# EAGLE design Qwiic_MLX90393_Magnetometer (EAGLE 7.7.0)
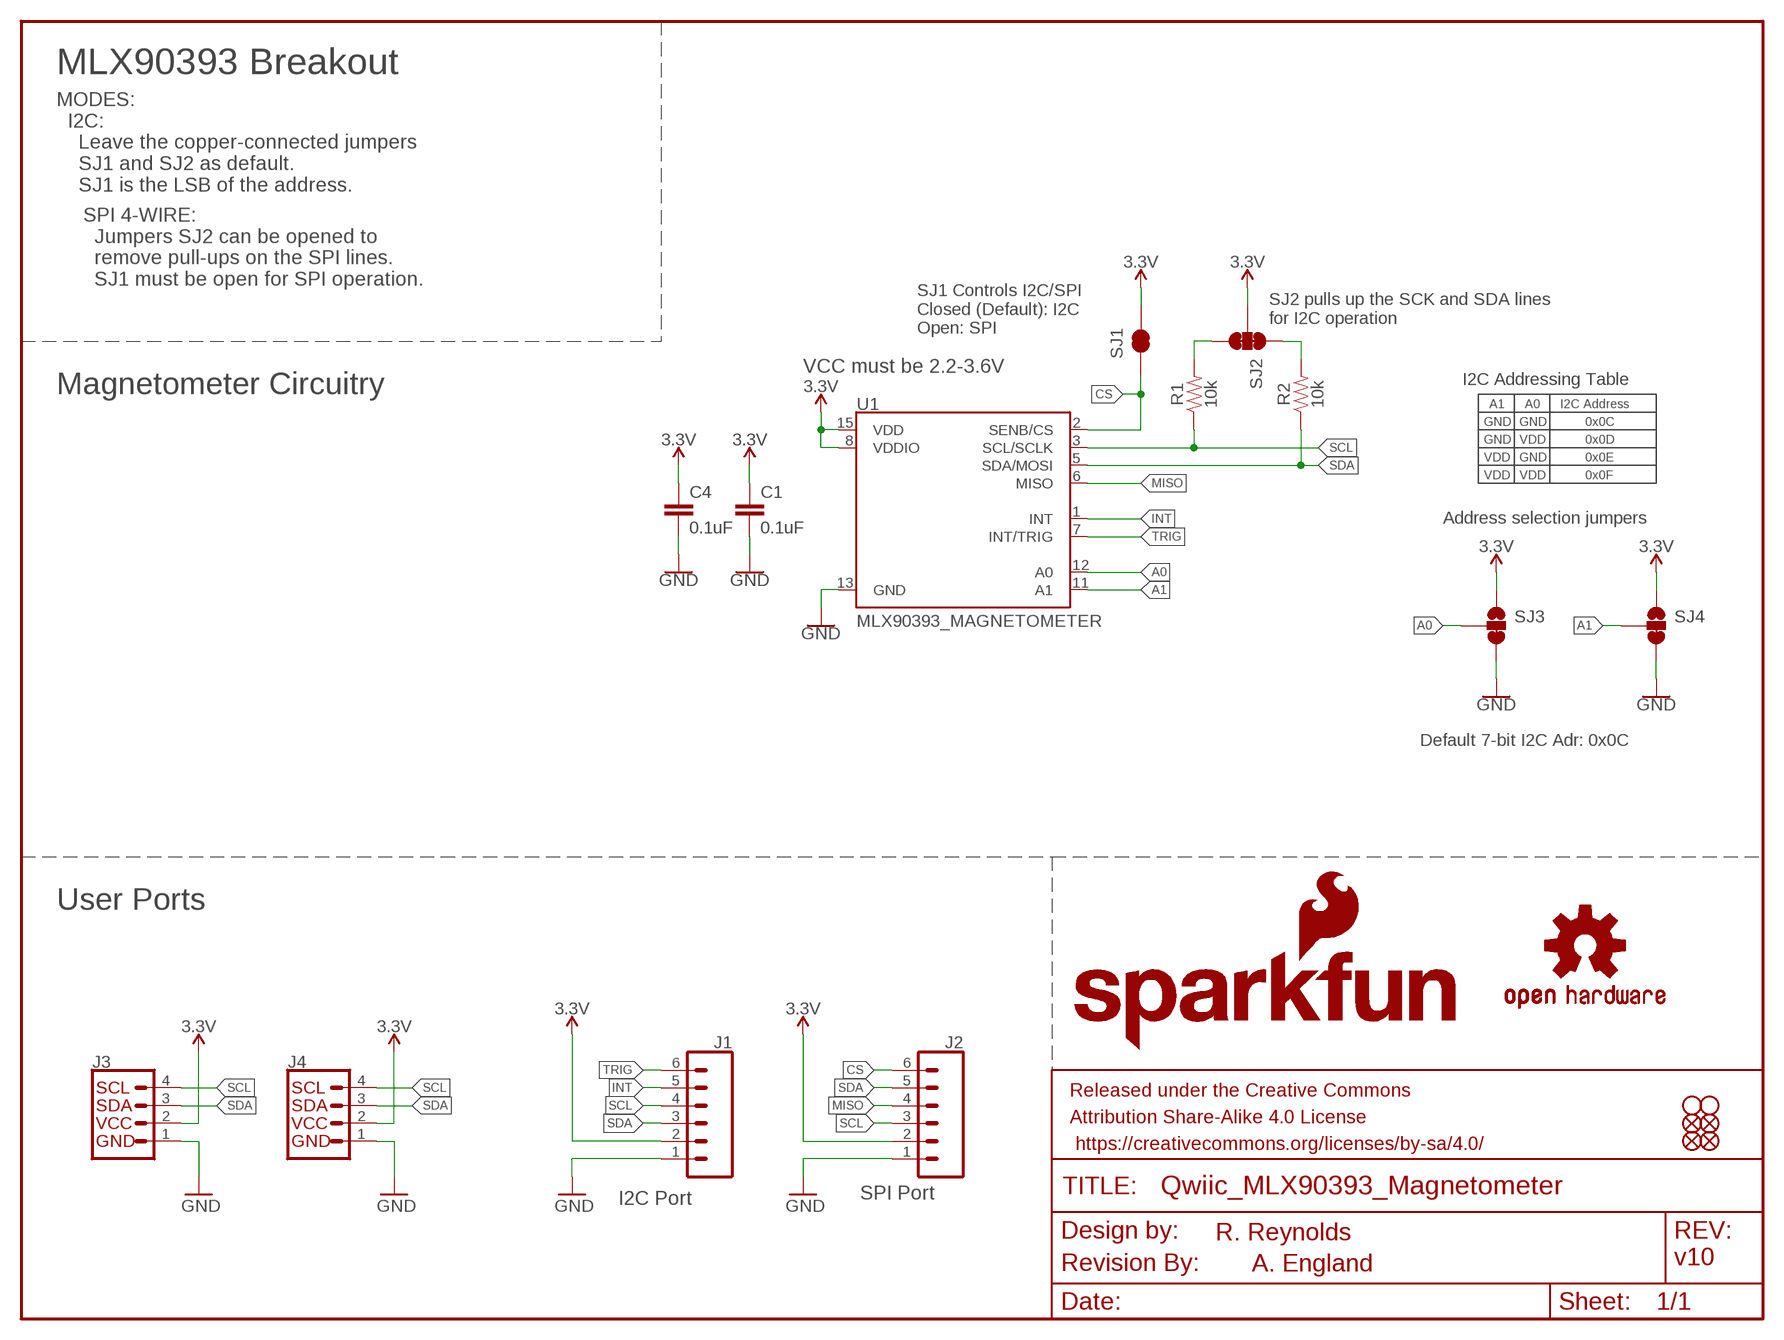
[diagram p0: schematic, sheet 1]

## Parts
C1  0.1uF  0.1UF-0603-25V-(+80/-20%)  [0603]
C4  0.1uF  0.1UF-0603-25V-(+80/-20%)  [0603]
FD1  FIDUCIALUFIDUCIAL  [FIDUCIAL-MICRO]
FD2  FIDUCIALUFIDUCIAL  [FIDUCIAL-MICRO]
FD3  FIDUCIALUFIDUCIAL  [FIDUCIAL-MICRO]
FD4  FIDUCIALUFIDUCIAL  [FIDUCIAL-MICRO]
FRAME2  FRAME-LETTER  [CREATIVE_COMMONS]
J1  CONN_06NO_SILK_FEMALE_PTH  [1X06_NO_SILK]
J2  CONN_06NO_SILK_FEMALE_PTH  [1X06_NO_SILK]
J3  QWIIC_CONNECTORJS-1MM  [1X04_1MM_RA]
J4  QWIIC_CONNECTORJS-1MM  [1X04_1MM_RA]
JP3  STAND-OFF  [STAND-OFF]
JP4  STAND-OFF  [STAND-OFF]
LOGO1  SFE_LOGO_NAME_FLAME.1_INCH  [SFE_LOGO_NAME_FLAME_.1]
LOGO2  SFE_LOGO_FLAME.1_INCH  [SFE_LOGO_FLAME_.1]
LOGO3  REVISION  [REVISION]
R1  10k  10KOHM-0603-1/10W-1%  [0603]
R2  10k  10KOHM-0603-1/10W-1%  [0603]
SJ1  JUMPER-SMT_2_NC_TRACE_SILK  [SMT-JUMPER_2_NC_TRACE_SILK]
SJ2  JUMPER-PAD-3-NC_BY_TRACE  [PAD-JUMPER-3-3OF3_NC_BY_TRACE_YES_SILK_FULL_BOX]
SJ3  JUMPER-SMT_3_1-NC_TRACE_SILK  [SMT-JUMPER_3_1-NC_TRACE_SILK]
SJ4  JUMPER-SMT_3_1-NC_TRACE_SILK  [SMT-JUMPER_3_1-NC_TRACE_SILK]
U1  MLX90393_MAGNETOMETER  [QFN-16_WITH_AXIES]
U$1  OSHW-LOGOS  [OSHW-LOGO-S]

## Nets
3.3V: C1.1 C4.1 J1.2 J2.2 J3.2 J4.2 SJ1.2 SJ2.2 SJ3.1 SJ4.1 U1.8(VDDIO) U1.15(VDD)
A0: SJ3.2 U1.12(A0)
A1: SJ4.2 U1.11(A1)
CS: J2.6 SJ1.1 U1.2(SENB/CS)
GND: C1.2 C4.2 J1.1 J2.1 J3.1 J4.1 SJ3.3 SJ4.3 U1.13(GND)
INT: J1.5 U1.1(INT)
MISO: J2.4 U1.6(MISO)
N$4: R2.2 SJ2.1
N$5: R1.2 SJ2.3
SCL: J1.4 J2.3 J3.4 J4.4 R1.1 U1.3(SCL/SCLK)
SDA: J1.3 J2.5 J3.3 J4.3 R2.1 U1.5(SDA/MOSI)
TRIG: J1.6 U1.7(INT/TRIG)

## Notes on the sheet
- MLX90393 Breakout
- MODES:
    I2C:
      Leave the copper-connected jumpers
      SJ1 and SJ2 as default.
      SJ1 is the LSB of the address.
- SPI 4-WIRE:
    Jumpers SJ2 can be opened to 
    remove pull-ups on the SPI lines.
    SJ1 must be open for SPI operation.
- SJ2 pulls up the SCK and SDA lines
  for I2C operation
- SJ1 Controls I2C/SPI
  Closed (Default): I2C
  Open: SPI
- VCC must be 2.2-3.6V
- I2C Addressing Table
- Magnetometer Circuitry
- A1 | A0 | I2C Address
- GND | GND | 0x0C
- GND | VDD | 0x0D
- VDD | GND | 0x0E
- VDD | VDD | 0x0F
- Address selection jumpers
- Default 7-bit I2C Adr: 0x0C
- User Ports
- I2C Port | SPI Port
- R. Reynolds
- A. England | v10

## Library data of the parts
C1 C4 = SparkFun-Capacitors:0.1UF: 0.1µF ceramic capacitors A capacitor is a passive two-terminal electrical component used to store electrical energy temporarily in an electric field.; PROD_ID: CAP-00810
FD1-FD4 = SparkFun-Aesthetics:FIDUCIAL: Fiducial Alignment Points Point-of-reference for pick-and-place machines and other optical instruments.
FRAME2 = SparkFun-Aesthetics:FRAME-LETTER: Schematic Frame Standard 8.5x11 US Letter frame
J1 J2 = SparkFun-Connectors:CONN_06: Header 6 Standard 6-pin 0.1" header. Use with straight break away headers (SKU : PRT-00116), right angle break away headers (PRT-00553), swiss pins (PRT-00743), machine pins (PRT-00117), and female headers (PRT-00115). Molex polarized connector foot print use with SKU : PRT-08094 with associated crimp pins and housings. NOTES ON THE VARIANTS LOCK and LOCK_LONGPADS... This footprint was designed to help hold the alignment of a through-hole component (i.e. 6-pin header) while soldering it into place. You may notice that each hole has been shifted either up or down by 0.005 of an inch from it's more standard position (which is a perfectly straight line). This slight alteration caused the pins (the squares in the middle) to touch the edges of the holes. Because they are alternating, it causes a "brace" to hold the component in place. 0.005 has proven to be the perfect amount of "off-center" position when using our standard breakaway headers. Although looks a little odd when you look at the bare footprint, once you have a header in there, the alteration is very hard to notice. Also,if you push a header all the way into place, it is covered up entirely on the bottom side. This idea of altering the position of holes to aid alignment will be further integrated into the Sparkfun Library for other footprints. It can help hold any component with 3 or more connection pins.; PROD_ID: CONN-08437
J3 J4 = SparkFun-Connectors:QWIIC_CONNECTOR: SparkFun I2C Standard Qwiic Connector An SMD 1mm pitch JST connector makes it easy and quick (get it? Qwiic?) to connect I2C devices to each other. The Qwiic system <http://www.sparkfun.com/qwiic> enables fast and solderless connection between popular platforms and various sensors and actuators. We carry 200mm <https://www.sparkfun.com/products/14204>, 100mm <https://www.sparkfun.com/products/14205>, 50mm <https://www.sparkfun.com/products/14206>, and breadboard friendly <https://www.sparkfun.com/products/14207> Qwiic cables. We also offer 10 pcs strips <https://www.sparkfun.com/products/14323> the SMD connectors.; PROD_ID: CONN-13694
JP3 JP4 = SparkFun:STAND-OFF: Stand Off This is the mechanical footprint for a #4 phillips button head screw. Use the keepout ring to avoid running the screw head into surrounding components. SKU : PRT-00447
LOGO1 = SparkFun-Aesthetics:SFE_LOGO_NAME_FLAME: SparkFun Font Logo w/ Flame This is the SparkFun full logo. The logo on the schematic will always be the same size; the package variant is the height of the flame part of the logo. Default layer for the logo on the board is tSilk.
LOGO2 = SparkFun-Aesthetics:SFE_LOGO_FLAME: SparkFun Flame Logo This is the SparkFun flame logo. The logo on the schematic will always be the same size; the package variant is the height of the flame. Default layer for the logo on the board is tSilk.
LOGO3 = SparkFun-Aesthetics:REVISION: "Revision By" Text Preceding text for revisor documentation. Includes schematic text on "symbols" layer, and board text on tDoc.
R1 R2 = SparkFun-Resistors:10KOHM: 10kΩ resistor A resistor is a passive two-terminal electrical component that implements electrical resistance as a circuit element. Resistors act to reduce current flow, and, at the same time, act to lower voltage levels within circuits.; PROD_ID: RES-00824
SJ1 = SparkFun-Jumpers:JUMPER-SMT_2_NC_TRACE: Normally closed trace jumper This jumper has a trace between two pads so it's normally closed (NC). Use a razor knife to open the connection. For best results follow the IPC guidelines for cutting traces: Cutout at least 0.063 mm (0.005 in). Remove all loose material to clean up the cut area. Seal the cut with an approved epoxy. Reapply solder to reclose the connection.
SJ2 = TestAperatures:JUMPER-PAD-3-NC_BY_TRACE
SJ3 SJ4 = SparkFun-Jumpers:JUMPER-SMT_3_1-NC_TRACE: Normally closed trace jumper (1 of 2 connections) This jumper has a trace between two pads so it's normally closed (NC). The other connection is normally open (NO). Use a razor knife to open the connection. For best results follow the IPC guidelines for cutting traces: Cutout at least 0.063 mm (0.005 in). Remove all loose material to clean up the cut area. Seal the cut with an approved epoxy. Reapply solder to reclose the connection, or to close the NO connection.
U1 = SparkFun-Sensors:MLX90393_MAGNETOMETER; PROD_ID: SEN-13886
U$1 = SparkFun:OSHW-LOGO: Open Source Hardware Logo This logo indicates the piece of hardware it is found on incorporates a OSHW license and/or adheres to the definition of open source hardware found here: http://freedomdefined.org/OSHW

## Board
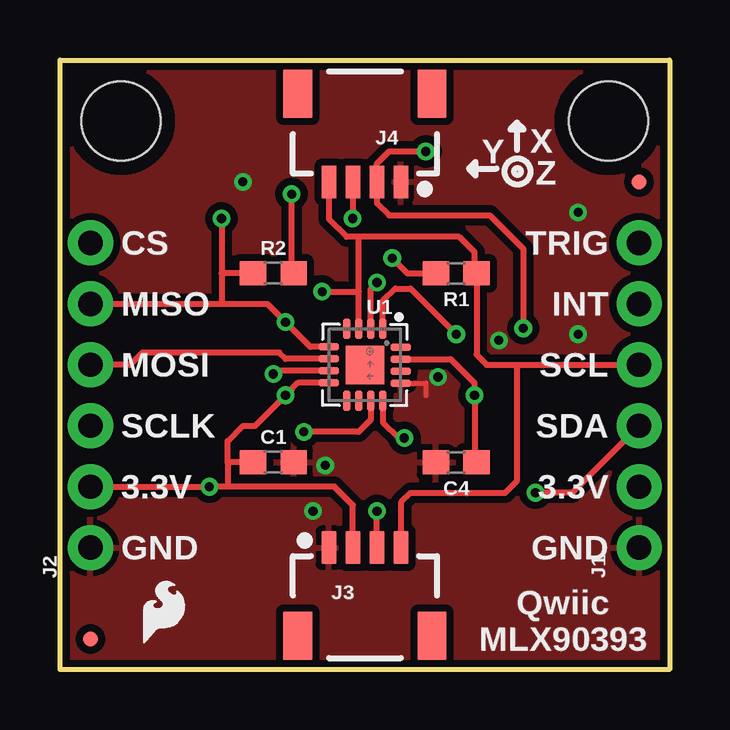
[diagram p1: board, top side]
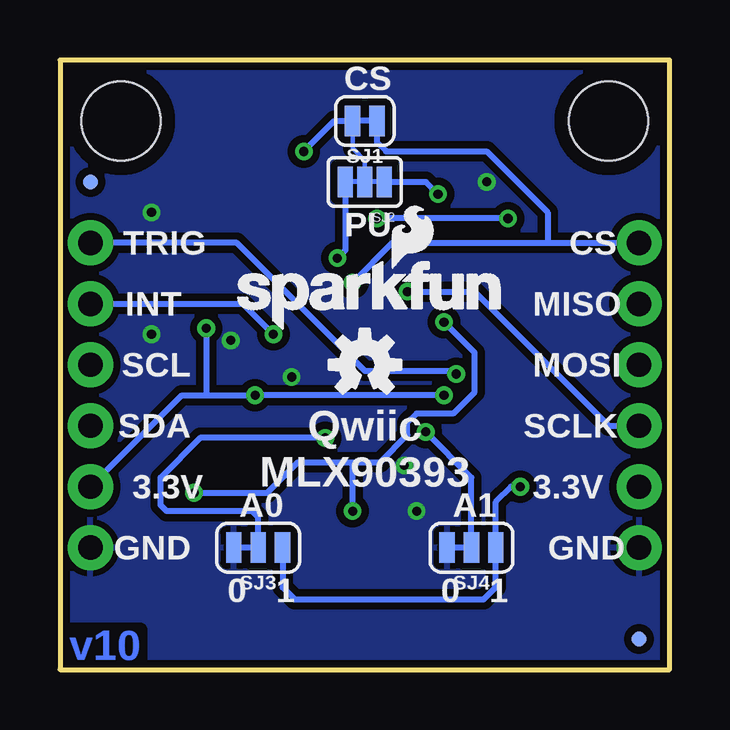
[diagram p2: board, bottom side, seen from below]

Size 25.4 x 25.4 mm. Coordinates in mm from the lower left corner, seen from the top.
Outline: 25.4,0 0,0 0,25.4 25.4,25.4 25.4,0
Copper layers (1*16): Top 0.035mm / dielectric 1.5mm / Bottom 0.035mm
Design rules "SparkFun-2-layer-TIGHT": minimum track width 7mil, minimum drill 15mil, track to track 7mil, track to pad 7mil, pad to pad 7mil, via to via 7mil, smd to smd 7mil, copper to edge 7mil, drill to drill 7mil, minimum pad ring 7mil, minimum via ring 7mil, stop-mask expansion 4mil, vias tented up to drill 25mil, thermal gap 10mil

### Footprints (pad centres in the part's own frame; a part is rotated, then mirrored left to right if it is on the bottom)
0603 = smd 1.1 x 1: 1 -0.85,0; 2 0.85,0
FIDUCIAL-MICRO = smd 0.635 x 0.635: 1 0,0
1X06_NO_SILK = drill 1.016 pad 1.88: 1 0,0; 2 2.54,0; 3 5.08,0; 4 7.62,0; 5 10.16,0; 6 12.7,0
1X04_1MM_RA = smd 0.6 x 1.35: 1 -1.5,0; 2 -0.5,0; 3 0.5,0; 4 1.5,0 | smd 1.2 x 2: NC1 2.8,-3.675; NC2 -2.8,-3.675
STAND-OFF = hole 3.302: 0,0
SMT-JUMPER_2_NC_TRACE_SILK = smd 0.635 x 1.27: 1 -0.508,0; 2 0.508,0
PAD-JUMPER-3-3OF3_NC_BY_TRACE_YES_SILK_FULL_BOX = smd 0.635 x 1.27: 1 -0.813,0; 2 0,0; 3 0.813,0
SMT-JUMPER_3_1-NC_TRACE_SILK = smd 0.635 x 1.27: 1 -1.016,0; 2 0,0; 3 1.016,0
QFN-16_WITH_AXIES = smd 0.3 x 0.85: 1 0.754,1.498; 2 0.254,1.498; 3 -0.246,1.498; 4 -0.746,1.498; 9 -0.746,-1.506; 10 -0.246,-1.506; 11 0.254,-1.506; 12 0.754,-1.506 | smd 0.85 x 0.3: 5 -1.508,0.746; 6 -1.508,0.246; 7 -1.508,-0.254; 8 -1.508,-0.754; 13 1.496,-0.764; 14 1.496,-0.264; 15 1.496,0.236; 16 1.496,0.736 | smd 1.6 x 1.6: 17 0,0

### Placement (x,y rotation side)
C1  8.89,8.64 0 top
C4  16.51,8.64 180 top
FD1  1.27,1.27 0 top
FD2  1.27,1.27 0 bottom
FD3  24.13,20.32 0 top
FD4  24.13,20.32 0 bottom
FRAME2  -20.95,-10.16 0 top  (outside the outline)
J1  24.13,5.08 90 top
J2  1.27,5.08 90 top
J3  12.7,5.08 0 top
J4  12.7,20.32 180 top
JP3  2.54,22.86 0 top
JP4  22.86,22.86 0 top
LOGO1  18.41,14.1 0 bottom
LOGO2  3.17,0.76 0 top
LOGO3  -8.89,-12.7 0 top  (outside the outline)
R1  16.51,16.51 180 top
R2  8.89,16.51 0 top
SJ1  12.7,22.86 180 bottom
SJ2  12.7,20.32 180 bottom
SJ3  17.14,5.08 180 bottom
SJ4  8.26,5.08 180 bottom
U1  12.7,12.7 0 top
U$1  12.7,12.7 0 bottom

### Tracks (layer width: path | path; a pad name or v marks a point on that pad's centre or on a via)
3.3V  (via drill 0.38)
  Top 0.254: v9.4,11.43 9.31,11.34 | v19.3,14.22 19.3,17.53 17.91,18.92 13.72,18.92 13.21,19.43 J4.2 13.2,21.07 13.72,21.59 v15.24,21.59 | J3.2 12.2,6.85 11.43,7.62 6.99,7.62 | J2.2 v6.22,7.62 6.99,7.62 | C1.1 6.99,8.64 | v9.4,11.43 9.69,11.72 | C4.1 17.27,8.72 v17.27,11.43 17.27,11.94 16.27,12.94 U1.15 | 6.99,8.64 6.99,7.62 | 6.99,8.64 6.99,9.53 7.62,10.16 8.13,10.16 v9.4,11.43 | U1.8 9.91,11.95 v9.4,11.43
  Bottom 0.178: SJ2.2 12.7,21.21 13.21,21.72 SJ1.2
  Bottom 0.254: v9.4,11.43 v17.27,11.43 19.3,11.43 | v6.22,7.62 6.6,7.62 7.24,6.99 SJ4.1 7.24,3.43 7.75,2.92 15.62,2.92 16.13,3.43 SJ3.1 | v15.24,21.59 13.97,22.86 SJ1.2 | J1.2 20.32,11.43 19.3,11.43 | v19.3,14.22 19.3,11.43
A0  (via drill 0.38)
  Top 0.254: v14.35,9.65 14.1,9.65 13.45,10.29 U1.12
  Bottom 0.254: v14.35,9.65 19.56,9.65 21.21,8 21.21,6.86 20.95,6.6 17.4,6.6 17.14,6.35 SJ3.2
A1  (via drill 0.38)
  Top 0.254: U1.11 12.95,10.41 12.45,9.91 v10.16,9.91
  Bottom 0.254: v10.16,9.91 8.26,8 SJ4.2
CS  (via drill 0.38)
  Top 0.254: 13.03,15.95 v13.21,16.13 12.95,15.88 U1.2
  Bottom 0.254: v13.21,16.13 11.56,17.78 5.08,17.78 | 5.08,17.78 J2.6 | 5.08,17.78 5.08,19.05 7.62,21.59 11.81,21.59 12.19,21.97 SJ1.1
GND  (via drill 0.38)
  Top 0.203: U1.13 15.24,11.94 15.24,11.43
  Top 0.254: J3.1 11.18,5.1
  Bottom 0.254: SJ3.3 18.29,5.08 18.16,4.95 | 1.27,4.45 J2.1
  other vias: 10.54,6.6 11.05,8.51 15.75,12.19 21.59,13.97 18.29,13.72 21.59,19.05 7.62,20.32
  pour Top (isolate 0.305): 0,25.4 0,0 25.4,0 25.4,25.4
  pour Bottom (isolate 0.305): 0,25.4 0,0 25.4,0 25.4,25.4
INT  (via drill 0.38)
  Top 0.254: v16.51,13.97 14.61,15.88 13.97,15.88 13.45,15.36 U1.1
  Bottom 0.254: J1.5 17.78,15.24 v16.51,13.97
MISO
  Top 0.254: J2.4 2.92,12.7 3.43,13.21 9.14,13.21 9.41,12.95 U1.6
N$4  (via drill 0.38)
  Top 0.254: R2.2 9.65,16.6 v9.65,19.81
  Bottom 0.254: SJ2.1 10.16,20.32 v9.65,19.81
N$5  (via drill 0.38)
  Top 0.254: v13.84,17.14 14.48,16.51 R1.2
  Bottom 0.254: SJ2.3 13.51,17.48 v13.84,17.14
SCL  (via drill 0.38)
  Top 0.254: J3.4 14.22,5.1 14.22,6.99 14.61,7.37 18.54,7.37 19.05,7.87 19.05,12.7 | 19.05,12.7 17.78,12.7 17.36,13.12 R1.1 17.27,16.6 17.27,17.4 16.64,18.03 12.45,18.03 | 19.05,12.7 J1.4 | 11.18,20.3 J4.4 11.2,18.77 11.94,18.03 12.45,18.03 | U1.3 12.45,15.75 | 12.45,15.75 12.45,18.03 | v10.92,15.75 12.45,15.75
  Bottom 0.254: J2.3 2.54,10.16 8.13,15.75 v10.92,15.75
SDA  (via drill 0.38)
  Top 0.254: J4.3 v12.19,18.8 | J2.5 6.73,15.24 | 6.73,15.24 8.64,15.24 v9.4,14.48 10.43,13.45 U1.5 | J3.3 v13.21,6.6 | 8,16.55 R2.1 6.73,16.51 | J1.3 21.34,7.37 v19.81,7.37 | v6.73,18.8 6.73,16.51 | 6.73,16.51 6.73,15.24
  Bottom 0.254: v6.73,18.8 v12.19,18.8 | v19.81,7.37 16.76,7.37 15.49,8.64 13.21,8.64 | 13.21,8.64 12.06,8.64 10.92,9.78 10.92,10.29 10.54,10.67 9.02,10.67 8.13,11.56 8.13,13.21 v9.4,14.48 | v13.21,6.6 13.21,8.64
TRIG  (via drill 0.38)
  Top 0.254: 8.95,12.38 v8.89,12.32 9.02,12.45 U1.7
  Bottom 0.254: J1.6 18.03,17.78 12.7,12.45 9.02,12.45 v8.89,12.32

### Text on the board
Bottom: v10
tPlace: X | Y | Z | CS | TRIG | MISO | INT | MOSI | SCL | SCLK | SDA | 3.3V | 3.3V | GND | GND | Qwiic / MLX90393
bPlace: CS | PU | CS | TRIG | MISO | INT | MOSI | SCL | SCLK | SDA | Qwiic / MLX90393 | 3.3V | A1 | A0 | 3.3V | GND | GND | 1 | 0 | 1 | 0
Measures: Units in inches
tDocu: R. Reynolds | A. England